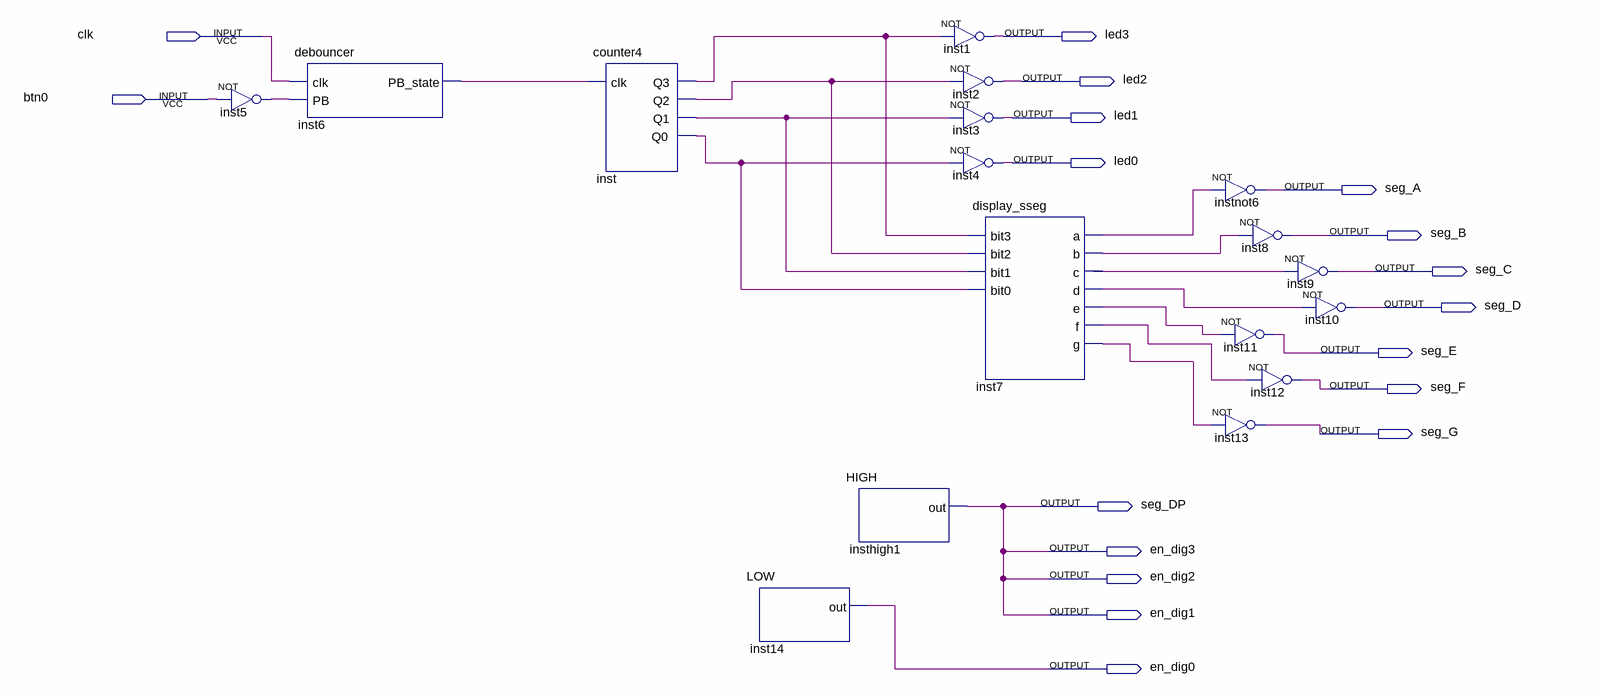
[diagram p0: schematic sheet]
// Quartus schematic test_counter4.bdf as structural Verilog: 17 symbols, 18 pins
module test_counter4 (
  input  clk,
  input  btn0,
  output led3,
  output led2,
  output led1,
  output led0,
  output seg_A,
  output seg_B,
  output seg_C,
  output seg_D,
  output seg_E,
  output seg_F,
  output seg_G,
  output seg_DP,
  output en_dig3,
  output en_dig2,
  output en_dig1,
  output en_dig0
);

  wire inst5_out, inst6_pb_state, inst7_a, inst7_b, inst7_c, inst7_d, inst7_e, inst7_f, inst7_g, inst_q0,
       inst_q1, inst_q2, inst_q3;

  not inst5 (inst5_out, btn0);
  debouncer inst6 (.clk(clk), .PB(inst5_out), .PB_state(inst6_pb_state));
  counter4 inst (.clk(inst6_pb_state), .Q3(inst_q3), .Q2(inst_q2), .Q1(inst_q1), .Q0(inst_q0));
  LOW inst14 (.out(en_dig0));
  HIGH insthigh1 (.out(en_dig1));
  not inst1 (led3, inst_q3);
  not inst2 (led2, inst_q2);
  not inst3 (led1, inst_q1);
  not inst4 (led0, inst_q0);
  display_sseg inst7 (
    .bit3(inst_q3), .bit2(inst_q2), .bit1(inst_q1), .bit0(inst_q0), .a(inst7_a), .b(inst7_b), .c(inst7_c),
    .d(inst7_d), .e(inst7_e), .f(inst7_f), .g(inst7_g));
  not instnot6 (seg_A, inst7_a);
  not inst8 (seg_B, inst7_b);
  not inst11 (seg_E, inst7_e);
  not inst12 (seg_F, inst7_f);
  not inst13 (seg_G, inst7_g);
  not inst9 (seg_C, inst7_c);
  not inst10 (seg_D, inst7_d);

  assign en_dig2 = en_dig1;
  assign en_dig3 = en_dig1;
  assign seg_DP = en_dig1;
endmodule
